# EAGLE design design (EAGLE 9.5.2)
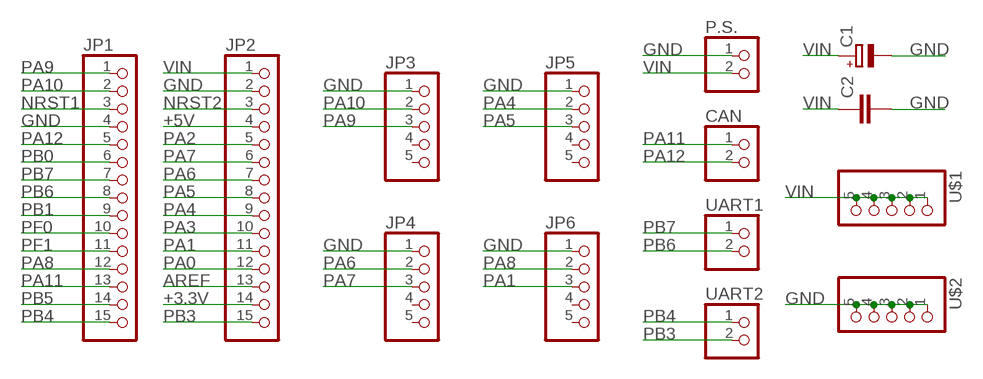
[diagram p0: schematic, sheet 1]

## Parts
C1  CPOL-EUE2.5-7  [E2,5-7]
C2  C-EU025-024X044  [C025-024X044]
CAN  ABOUTERS_2PIN  [22-23-2021]
JP1  PINHD-1X15  [1X15]
JP2  PINHD-1X15  [1X15]
JP3  PINHD-1X5/90  [1X05/90]
JP4  PINHD-1X5/90  [1X05/90]
JP5  PINHD-1X5/90  [1X05/90]
JP6  PINHD-1X5/90  [1X05/90]
P.S.  ABOUTERS_2PIN  [22-23-2021]
U$1  ABOUTERS_5PIN  [22-23-2051]
U$2  ABOUTERS_5PIN  [22-23-2051]
UART1  ABOUTERS_2PIN  [22-23-2021]
UART2  ABOUTERS_2PIN  [22-23-2021]

## Nets
+3.3V: JP2.14
+5V: JP2.4
AREF: JP2.13
GND: C1.- C2.2 JP1.4 JP2.2 JP3.1 JP4.1 JP5.1 JP6.1 P.S..1 U$2.1 U$2.2 U$2.3 U$2.4 U$2.5
NRST1: JP1.3
NRST2: JP2.3
PA0: JP2.12
PA1: JP2.11 JP6.3
PA2: JP2.5
PA3: JP2.10
PA4: JP2.9 JP5.2
PA5: JP2.8 JP5.3
PA6: JP2.7 JP4.2
PA7: JP2.6 JP4.3
PA8: JP1.12 JP6.2
PA9: JP1.1 JP3.3
PA10: JP1.2 JP3.2
PA11: CAN.1 JP1.13
PA12: CAN.2 JP1.5
PB0: JP1.6
PB1: JP1.9
PB3: JP2.15 UART2.2
PB4: JP1.15 UART2.1
PB5: JP1.14
PB6: JP1.8 UART1.2
PB7: JP1.7 UART1.1
PF0: JP1.10
PF1: JP1.11
VIN: C1.+ C2.1 JP2.1 P.S..2 U$1.1 U$1.2 U$1.3 U$1.4 U$1.5
Unconnected: JP3.4 JP3.5 JP4.4 JP4.5 JP5.4 JP5.5 JP6.4 JP6.5

## Library data of the parts
C1 = rcl:CPOL-EU: POLARIZED CAPACITOR, European symbol; SPICEPREFIX: C
C2 = rcl:C-EU: CAPACITOR, European symbol; SPICEPREFIX: C
CAN P.S. UART1 UART2 = abouters_pin (1):ABOUTERS_2PIN
JP1 JP2 = pinhead:PINHD-1X15: PIN HEADER
JP3-JP6 = pinhead:PINHD-1X5: PIN HEADER
U$1 U$2 = abouters_pin (1):ABOUTERS_5PIN

## Board
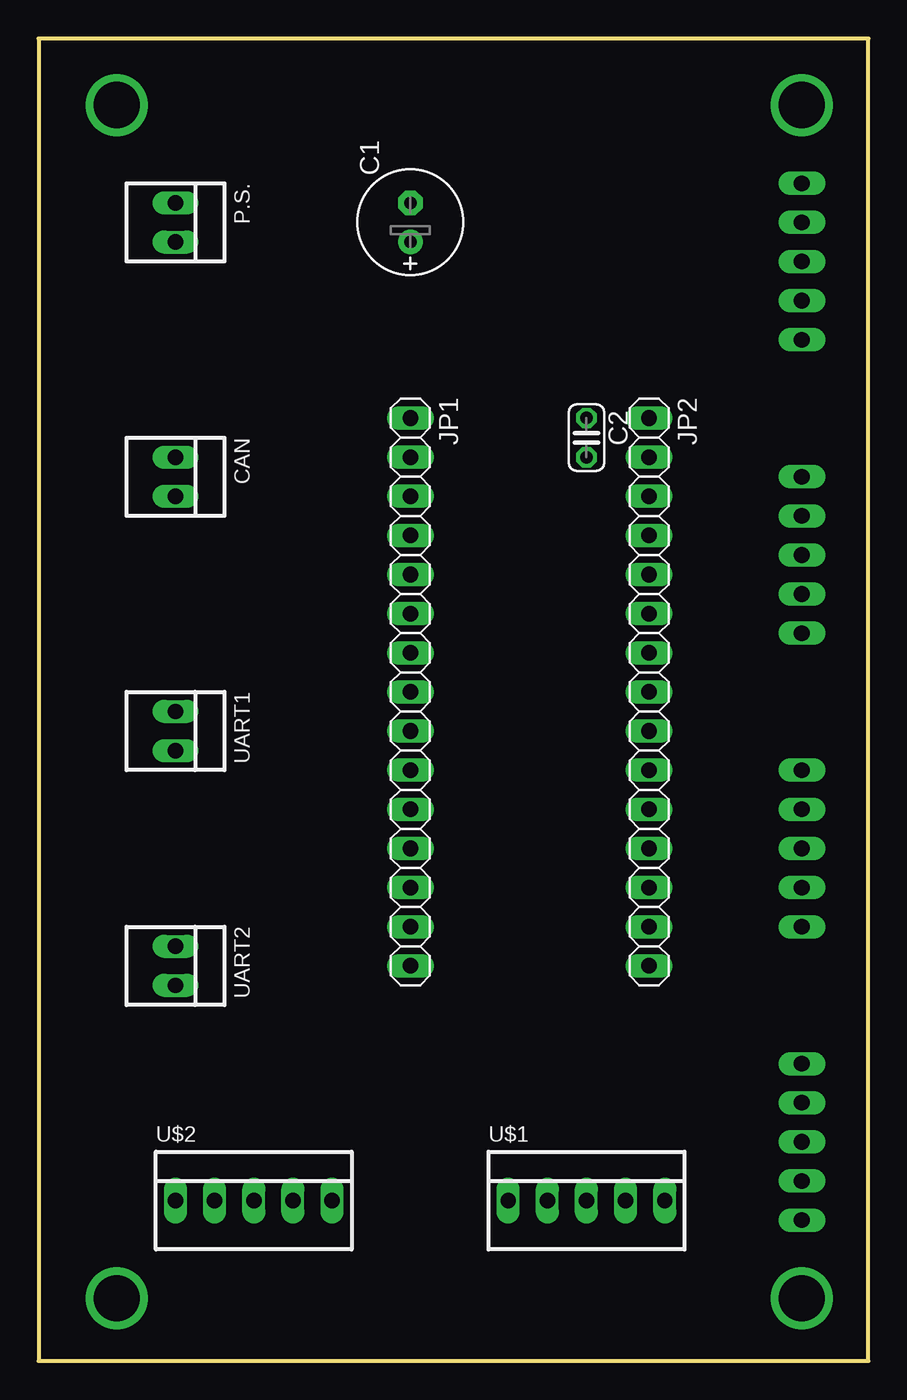
[diagram p1: board, top side]
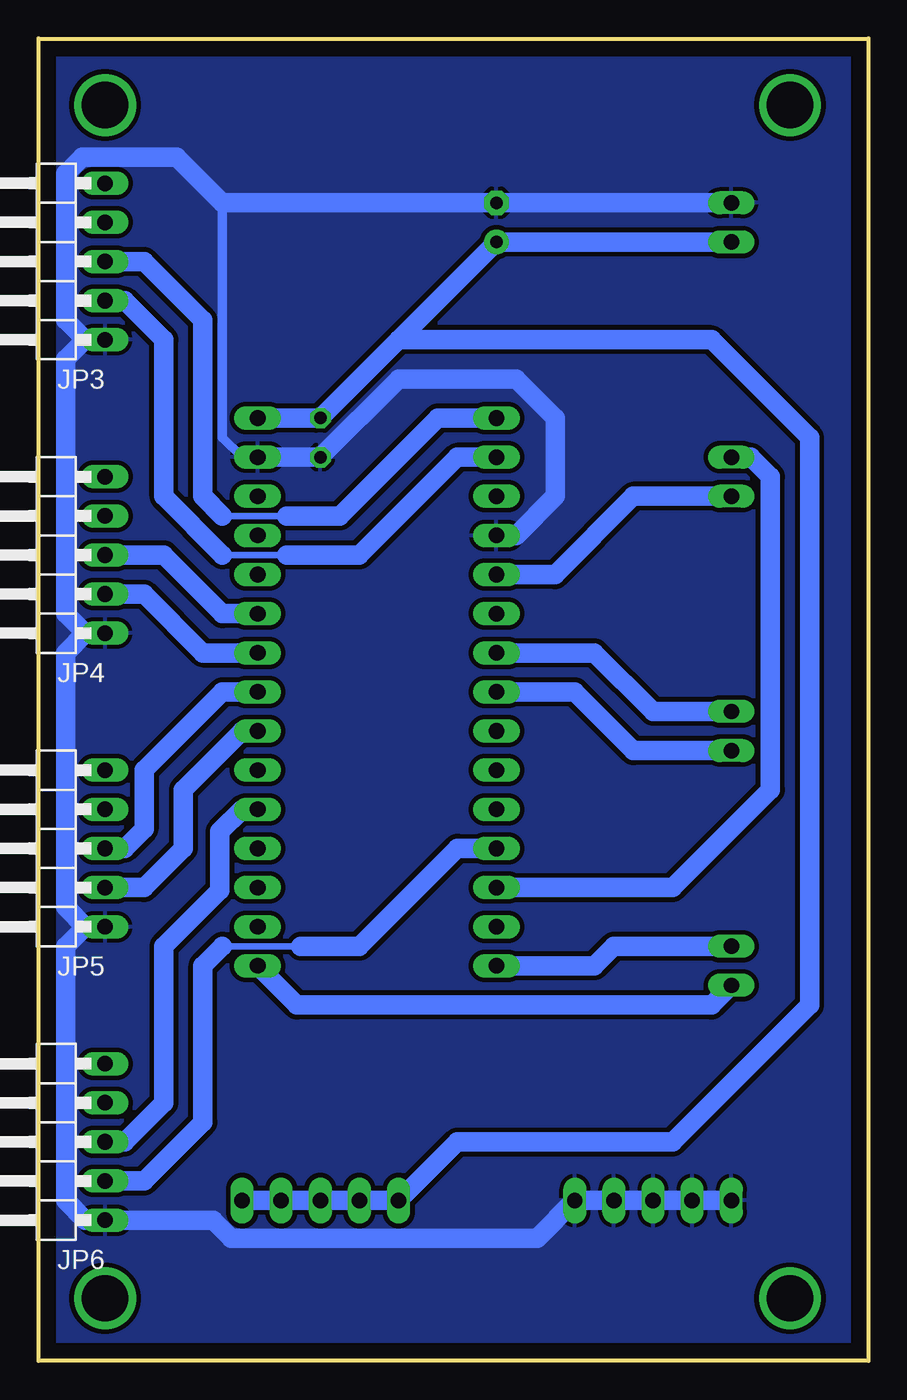
[diagram p2: board, bottom side, seen from below]

Size 53.85 x 85.85 mm. Coordinates in mm from the lower left corner, seen from the top.
Outline: 0,85.85 0,0 53.85,0 53.85,85.85 0,85.85
Copper layers (1*16): Top 0.035mm / dielectric 1.5mm / Bottom 0.035mm
Design rules "default *": minimum track width 6mil, minimum drill 0.35mm, track to track 0.3mm, track to pad 0.3mm, pad to pad 0.3mm, via to via 0.3mm, smd to smd 0.3mm, copper to edge 40mil, drill to drill 6mil, minimum pad ring 10mil, minimum via ring 8mil, stop-mask expansion 4mil, vias tented up to drill 0mil, thermal gap 10mil

### Footprints (pad centres in the part's own frame; a part is rotated, then mirrored left to right if it is on the bottom)
E2,5-7 = drill 0.813 pad 1.6: + -1.27,0 | drill 0.813 pad 1.6 octagon: - 1.27,0
C025-024X044 = drill 0.813 octagon: 1 -1.27,0; 2 1.27,0
22-23-2021 = drill 1 long: 1 -1.27,0; 2 1.27,0
1X15 = drill 1.016 long: 1 -17.78,0; 2 -15.24,0; 3 -12.7,0; 4 -10.16,0; 5 -7.62,0; 6 -5.08,0; 7 -2.54,0; 8 0,0; 9 2.54,0; 10 5.08,0; 11 7.62,0; 12 10.16,0; 13 12.7,0; 14 15.24,0; 15 17.78,0
1X05/90 = drill 1.016 long: 1 -5.08,-3.81; 2 -2.54,-3.81; 3 0,-3.81; 4 2.54,-3.81; 5 5.08,-3.81
22-23-2051 = drill 1 long: 1 -5.08,0; 2 -2.54,0; 3 0,0; 4 2.54,0; 5 5.08,0

### Placement (x,y rotation side)
C1  24.13,73.91 90 top
C2  35.56,59.94 270 top
CAN  8.89,57.4 270 top
JP1  24.13,43.43 270 top
JP2  39.62,43.43 270 top
JP3  53.34,71.37 90 bottom
JP4  53.34,52.32 90 bottom
JP5  53.34,33.27 90 bottom
JP6  53.34,14.22 90 bottom
P.S.  8.89,73.91 270 top
U$1  35.56,10.41 0 top
U$2  13.97,10.41 0 top
UART1  8.89,40.89 270 top
UART2  8.89,25.65 270 top

### Tracks (layer width: path | path; a pad name or v marks a point on that pad's centre or on a via)
GND
  Bottom 0.61: JP2.2 40.64,58.67 41.91,59.94 41.91,75.18
  Bottom 1.27: JP2.2 C2.2 30.48,63.75 22.86,63.75 20.32,61.21 20.32,56.13 22.86,53.59 JP1.4 | U$2.1 U$2.2 U$2.3 U$2.4 U$2.5 21.49,7.97 41.34,7.97 42.51,9.14 JP6.1 50.8,9.14 52.07,10.41 52.07,26.92 50.8,28.19 | JP3.1 50.8,66.29 | 50.8,66.29 52.07,65.02 52.07,48.51 50.8,47.24 | 50.8,47.24 JP4.1 | JP5.1 50.8,28.19 | 50.8,28.19 52.07,29.46 52.07,45.97 50.8,47.24 | P.S..1 C1.- 41.91,75.18 44.88,78.15 50.99,78.15 52.07,77.08 52.07,67.56 50.8,66.29
  pour Bottom: -1.27,86.61 -1.27,-1.02 54.61,-1.02 54.61,86.61
N$1  (via drill 3)
  other vias: 49.53,4.06
N$2  (via drill 3)
  other vias: 5.08,4.06
N$3  (via drill 3)
  other vias: 5.08,81.53
N$4  (via drill 3)
  other vias: 49.53,81.53
PA1
  Bottom 1.27: JP2.11 40.64,35.81 42.08,34.37 42.08,30.56 45.72,26.92 45.72,16.76 48.26,14.22 JP6.3
PA4
  Bottom 1.27: JP2.9 40.64,40.89 44.45,37.08 44.45,33.27 46.99,30.73 JP5.2
PA5
  Bottom 1.27: JP2.8 41.91,43.43 46.99,38.35 46.99,34.54 48.26,33.27 JP5.3
PA6
  Bottom 1.27: JP2.7 43.18,45.97 46.99,49.78 JP4.2
PA7
  Bottom 1.27: JP2.6 41.91,48.51 45.72,52.32 JP4.3
PA8
  Bottom 0.406: 36.83,26.92 41.91,26.92
  Bottom 1.27: JP6.2 46.99,11.68 43.18,15.49 43.18,25.65 41.91,26.92 | 36.83,26.92 33.02,26.92 26.67,33.27 JP1.12
PA9
  Bottom 0.406: 37.73,54.86 41.91,54.86
  Bottom 1.27: JP1.1 27.94,61.21 34.29,54.86 37.73,54.86 | 41.91,54.86 43.18,56.13 43.18,67.56 46.99,71.37 JP3.3
PA10
  Bottom 0.406: 37.73,52.32 41.91,52.32
  Bottom 1.27: JP1.2 26.67,58.67 33.02,52.32 37.73,52.32 | 41.91,52.32 45.72,56.13 45.72,66.29 48.26,68.83 JP3.2
PA11
  Bottom 1.27: JP1.13 12.7,30.73 6.35,37.08 6.35,57.4 7.62,58.67 CAN.1
PA12
  Bottom 1.27: CAN.2 15.24,56.13 20.32,51.05 JP1.5
PB3
  Bottom 1.27: UART2.2 10.16,23.11 37.08,23.11 JP2.15
PB4
  Bottom 1.27: UART2.1 16.51,26.92 17.78,25.65 JP1.15
PB6
  Bottom 1.27: UART1.2 15.24,39.62 19.05,43.43 JP1.8
PB7
  Bottom 1.27: UART1.1 13.97,42.16 17.78,45.97 JP1.7
VIN
  Bottom 1.27: P.S..2 C1.+ 30.48,66.29 | 30.48,66.29 C2.1 JP2.1 | U$1.5 U$1.4 U$1.3 U$1.2 U$1.1 26.67,14.22 12.7,14.22 3.81,23.11 3.81,59.94 10.16,66.29 30.48,66.29